# Altium project SDP.PrjPcb
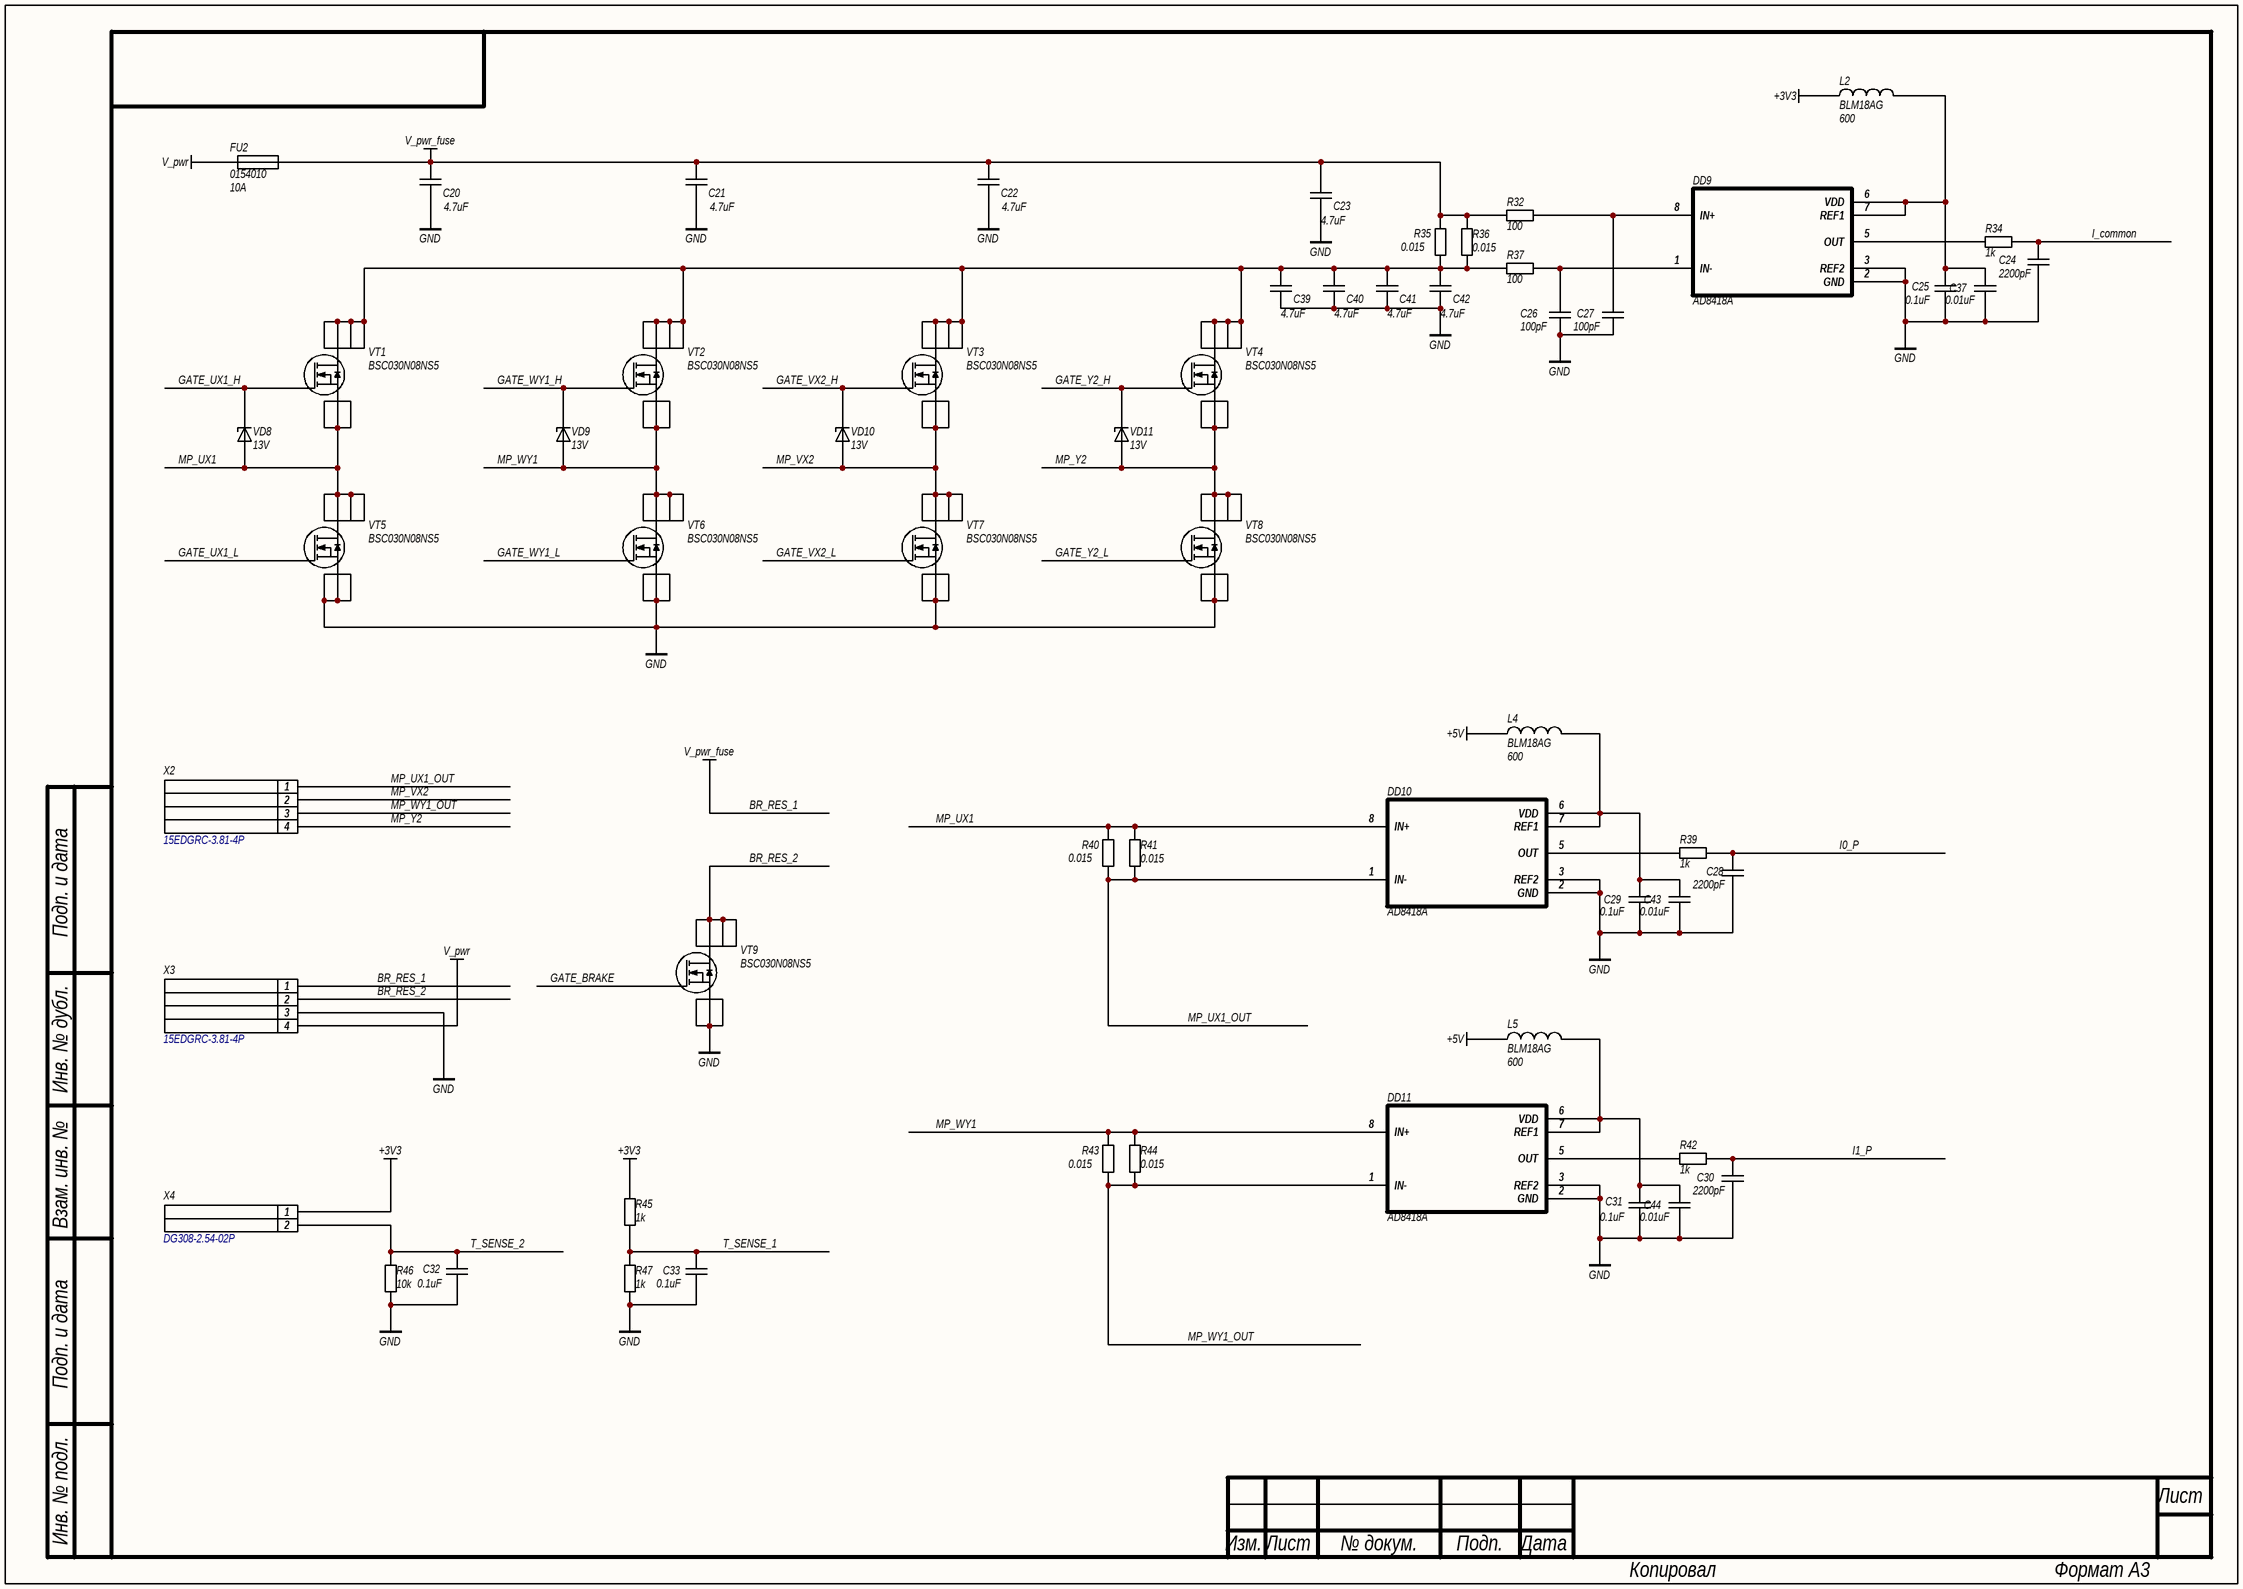
[diagram p0: SDP_2.SchDoc]
1 sheet, 58 parts. Net scope: global (net labels, ports and power ports of the same name join across sheets).
Board file: SDP.PcbDoc

## Sheet SDP_2.SchDoc
size 420 x 297 mm; PageSetup: Record=PageOptions|CenterHorizontal=False|CenterVertical=False|PrintScale=0.95|XCorrection=0.00|YCorrection=0.00|PrintKind=1|BorderSize=5000000|LeftOffset=0|BottomOffset=0|Orientation=1|PaperLength=1000|PaperWidth=1000|Scale=100|PaperSource=15|PrintQuality=600|MediaType=1|DitherType=10|PaperKind=A4|PrintScaleMode=1

### Parts
C20  value 4.7uF  [C1210]  (hidden comment: CAP)
C21  value 4.7uF  [C1210]  (hidden comment: CAP)
C22  value 4.7uF  [C1210]  (hidden comment: CAP)
C23  value 4.7uF  [C1210]  (hidden comment: CAP)
C24  value 2200pF  [C0603]  (hidden comment: CAP)
C25  value 0.1uF  [C0603]  (hidden comment: CAP)
C26  value 100pF  [C0603]  (hidden comment: CAP)
C27  value 100pF  [C0603]  (hidden comment: CAP)
C28  value 2200pF  [C0603]  (hidden comment: CAP)
C29  value 0.1uF  [C0603]  (hidden comment: CAP)
C30  value 2200pF  [C0603]  (hidden comment: CAP)
C31  value 0.1uF  [C0603]  (hidden comment: CAP)
C32  value 0.1uF  [C0603]  (hidden comment: CAP)
C33  value 0.1uF  [C0603]  (hidden comment: CAP)
C37  value 0.01uF  [C0603]  (hidden comment: CAP)
C39  value 4.7uF  [C1210]  (hidden comment: CAP)
C40  value 4.7uF  [C1210]  (hidden comment: CAP)
C41  value 4.7uF  [C1210]  (hidden comment: CAP)
C42  value 4.7uF  [C1210]  (hidden comment: CAP)
C43  value 0.01uF  [C0603]  (hidden comment: CAP)
C44  value 0.01uF  [C0603]  (hidden comment: CAP)
DD9  AD8418A  [MSOP8]
DD10  AD8418A  [MSOP8]
DD11  AD8418A  [MSOP8]
FU2  0154010  current: 10A  [omni_block_154]
L2  BLM18AG  value 600  [R0603]
L4  BLM18AG  value 600  [R0603]
L5  BLM18AG  value 600  [R0603]
R32  value 100  [R0603]  (hidden comment: RES)
R34  value 1k  [R0603]  (hidden comment: RES)
R35  value 0.015  [R2512]  (hidden comment: 2512)
R36  value 0.015  [R2512]  (hidden comment: 2512)
R37  value 100  [R0603]  (hidden comment: RES)
R39  value 1k  [R0603]  (hidden comment: RES)
R40  value 0.015  [R2512]  (hidden comment: 2512)
R41  value 0.015  [R2512]  (hidden comment: 2512)
R42  value 1k  [R0603]  (hidden comment: RES)
R43  value 0.015  [R2512]  (hidden comment: 2512)
R44  value 0.015  [R2512]  (hidden comment: 2512)
R45  value 1k  [R0603]  (hidden comment: RES)
R46  value 10k  [R0603]  (hidden comment: RES)
R47  value 1k  [R0603]  (hidden comment: RES)
VD8  Voltage: 13V  [SOD323]  (hidden comment: BZX384)
VD9  Voltage: 13V  [SOD323]  (hidden comment: BZX384)
VD10  Voltage: 13V  [SOD323]  (hidden comment: BZX384)
VD11  Voltage: 13V  [SOD323]  (hidden comment: BZX384)
VT1  BSC030N08NS5  [TDSON-8]
VT2  BSC030N08NS5  [TDSON-8]
VT3  BSC030N08NS5  [TDSON-8]
VT4  BSC030N08NS5  [TDSON-8]
VT5  BSC030N08NS5  [TDSON-8]
VT6  BSC030N08NS5  [TDSON-8]
VT7  BSC030N08NS5  [TDSON-8]
VT8  BSC030N08NS5  [TDSON-8]
VT9  BSC030N08NS5  [TDSON-8]
X2  15EDGRC-3.81-4P  [15EDGRC]
X3  15EDGRC-3.81-4P  [15EDGRC]
X4  DG308-2.54-02P  [DG308-2.54-2]

### Nets
+3V3: L2.1 R45.2 X4.1
+5V: L4.1 L5.1
BR_RES_1: C20.2 C21.2 C22.2 C23.2 FU2.2 R32.1 R35.2 R36.2 X3.1  [also labelled V_pwr_fuse]
GND: C20.1 C21.1 C22.1 C23.1 C24.1 C25.1 C26.1 C27.1 C28.1 C29.1 C30.1 C31.1 C32.1 C33.1 C37.1 C39.1 C40.1 C41.1 C42.1 C43.1 C44.1 DD9.2(GND) DD9.3(REF2) DD10.2(GND) DD10.3(REF2) DD11.2(GND) DD11.3(REF2) R46.1 R47.1 VT5.1(S) VT5.2(S) VT5.3(S) VT6.1(S) VT6.2(S) VT6.3(S) VT7.1(S) VT7.2(S) VT7.3(S) VT8.1(S) VT8.2(S) VT8.3(S) VT9.1(S) VT9.2(S) VT9.3(S) X3.3
V_pwr: FU2.1 X3.4
BR_RES_2: VT9.5(D) VT9.6(D) VT9.7(D) VT9.8(D) X3.2
GATE_BRAKE: VT9.4(G)
GATE_UX1_H: VD8.2(K) VT1.4(G)
GATE_UX1_L: VT5.4(G)
GATE_VX2_H: VD10.2(K) VT3.4(G)
GATE_VX2_L: VT7.4(G)
GATE_WY1_H: VD9.2(K) VT2.4(G)
GATE_WY1_L: VT6.4(G)
GATE_Y2_H: VD11.2(K) VT4.4(G)
GATE_Y2_L: VT8.4(G)
I0_P: C28.2 R39.2
I1_P: C30.2 R42.2
I_common: C24.2 R34.2
MP_UX1: DD10.8(IN+) R40.2 R41.2 VD8.1(A) VT1.1(S) VT1.2(S) VT1.3(S) VT5.5(D) VT5.6(D) VT5.7(D) VT5.8(D)
MP_UX1_OUT: DD10.1(IN-) R40.1 R41.1 X2.1
MP_VX2: VD10.1(A) VT3.1(S) VT3.2(S) VT3.3(S) VT7.5(D) VT7.6(D) VT7.7(D) VT7.8(D) X2.2
MP_WY1: DD11.8(IN+) R43.2 R44.2 VD9.1(A) VT2.1(S) VT2.2(S) VT2.3(S) VT6.5(D) VT6.6(D) VT6.7(D) VT6.8(D)
MP_WY1_OUT: DD11.1(IN-) R43.1 R44.1 X2.3
MP_Y2: VD11.1(A) VT4.1(S) VT4.2(S) VT4.3(S) VT8.5(D) VT8.6(D) VT8.7(D) VT8.8(D) X2.4
T_SENSE_1: C33.2 R45.1 R47.2
T_SENSE_2: C32.2 R46.2 X4.2
NetC25_2: C25.2 C37.2 DD9.6(VDD) DD9.7(REF1) L2.2
NetC26_2: C26.2 DD9.1(IN-) R37.2
NetC27_2: C27.2 DD9.8(IN+) R32.2
NetC29_2: C29.2 C43.2 DD10.6(VDD) DD10.7(REF1) L4.2
NetC31_2: C31.2 C44.2 DD11.6(VDD) DD11.7(REF1) L5.2
NetC39_2: C39.2 C40.2 C41.2 C42.2 R35.1 R36.1 R37.1 VT1.5(D) VT1.6(D) VT1.7(D) VT1.8(D) VT2.5(D) VT2.6(D) VT2.7(D) VT2.8(D) VT3.5(D) VT3.6(D) VT3.7(D) VT3.8(D) VT4.5(D) VT4.6(D) VT4.7(D) VT4.8(D)
NetDD9_5: DD9.5(OUT) R34.1
NetDD10_5: DD10.5(OUT) R39.1
NetDD11_5: DD11.5(OUT) R42.1

### Notes on the sheet
- Подп. и дата
- Инв. № дубл.
- Взам. инв. №
- Инв. № подл.
- Лист
- Изм.
- № докум.
- Подп.
- Дата
- Копировал
- Формат А3

### Library data of the parts
C20-C23 C39-C42 = CAP: SMD Capacitor; Manufacturer: Murata; Material: X7R; Tolerance: 10%; Voltage: 100V; Type: Ceramic Capacitor
C24-C33 C37 C43 C44 = CAP: SMD Capacitor; Manufacturer: Murata; Material: X7R; Tolerance: 10%; Voltage: 50V; Type: Ceramic Capacitor
DD9-DD11 = AD8418ABRMZ
FU2 = 0154010: omni fuse block
R32 R34 R37 R39 R42 R45-R47 = RES: SMD Resistor; Name: Chip SMD Resistor; Power: 0.062 Wt; Tolerance: 5%; Temperature Range: -55…155°C
R35 R36 R40 R41 R43 R44 = RES2512: SMD Resistor; Name: Chip SMD Resistor; Power: 1 W; Tolerance: 5%; Temperature Range: -55…155°C
VT1-VT9 = BSC030N08NS5: MOSFET-N